# EAGLE schematic Minidev_V1.0 (EAGLE 8.7.1)
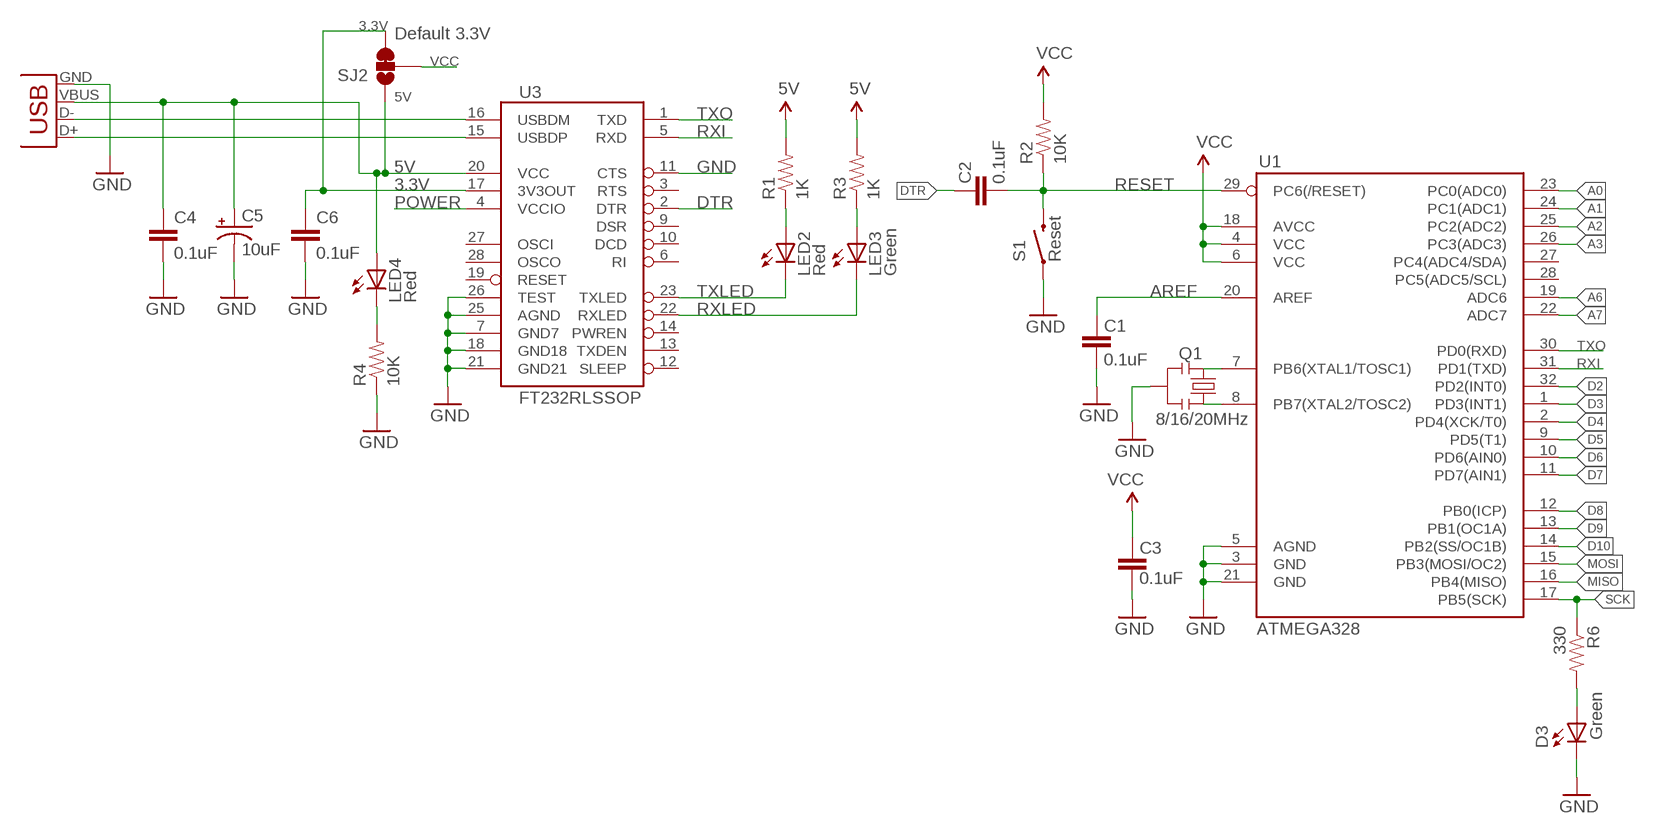
[diagram p0: schematic, sheet 1]

## Parts
C1  0.1uF  CAP0603-CAP  [0603-CAP]
C2  0.1uF  CAP0603-CAP  [0603-CAP]
C3  0.1uF  CAP0603-CAP  [0603-CAP]
C4  0.1uF  CAP0402-CAP  [0402-CAP]
C5  10uF  CAP_POL1206  [EIA3216]
C6  0.1uF  CAP0402-CAP  [0402-CAP]
D3  Green  LED  [0603-LED-ALT1]
LED2  Red  LED0603  [LED-0603]
LED3  Green  LED0603  [LED-0603]
LED4  Red  LED  [0603-LED-ALT1]
Q1  8/16/20MHz  RESONATOR1:1  [RESONATOR-SMD-1:1]
R1  1K  RESISTOR0402-RES  [0402-RES]
R2  10K  RESISTOR0603-RES  [0603-RES]
R3  1K  RESISTOR0402-RES  [0402-RES]
R4  10K  RESISTOR0603-RES  [0603-RES]
R6  330  RESISTOR0603-RES  [0603-RES]
S1  Reset  SWITCH-MOMENTARY-2SMD-ALT01  [TACTILE-SWITCH-SMD-ALT01]
SJ2  SOLDERJUMPER_2WAYS  [SJ_3]
U1  ATMEGA328  ATMEGA168  [TQFP32-08]
U3  FT232RLSSOP  [SSOP28DB]
X2  USB-SMD-NS  [USB-MINIB-NOSTOP]

## Nets
3.3V [power]: C6.1 SJ2.3 U3.17(3V3OUT)
5V: C4.1 C5.A(+) LED4.A R1.2 R3.2 SJ2.1 U3.20(VCC) X2.VBUS
A0: U1.23(PC0(ADC0))
A1: U1.24(PC1(ADC1))
A2: U1.25(PC2(ADC2))
A3: U1.26(PC3(ADC3))
A6: U1.19(ADC6)
A7: U1.22(ADC7)
AREF: C1.2 U1.20(AREF)
D2: U1.32(PD2(INT0))
D3: U1.1(PD3(INT1))
D4: U1.2(PD4(XCK/T0))
D5: U1.9(PD5(T1))
D6: U1.10(PD6(AIN0))
D7: U1.11(PD7(AIN1))
D8: U1.12(PB0(ICP))
D9: U1.13(PB1(OC1A))
D10: U1.14(PB2(SS/OC1B))
DTR: C2.2 U3.2(DTR)
GND [power]: C1.1 C3.1 C4.2 C5.C(-) C6.2 D3.C Q1.2 R4.1 S1.1 S1.2 U1.3(GND) U1.5(AGND) U1.21(GND) U3.7(GND7) U3.11(CTS) U3.18(GND18) U3.21(GND21) U3.25(AGND) U3.26(TEST) X2.GND
MISO: U1.16(PB4(MISO))
MOSI: U1.15(PB3(MOSI/OC2))
N$1: Q1.3 U1.8(PB7(XTAL2/TOSC2))
N$2: Q1.1 U1.7(PB6(XTAL1/TOSC1))
N$5: LED2.A R1.1
N$6: LED3.A R3.1
N$7: D3.A R6.2
N$9: LED4.C R4.2
POWER: U3.4(VCCIO)
RESET: C2.1 R2.1 S1.3 S1.4 U1.29(PC6(/RESET))
RXI: U1.31(PD1(TXD)) U3.5(RXD)
RXLED: LED3.C U3.22(RXLED)
SCK: R6.1 U1.17(PB5(SCK))
TXLED: LED2.C U3.23(TXLED)
TXO: U1.30(PD0(RXD)) U3.1(TXD)
USB_D+: U3.15(USBDP) X2.D+
USB_D-: U3.16(USBDM) X2.D-
VCC: C3.2 R2.2 SJ2.2 U1.4(VCC) U1.6(VCC) U1.18(AVCC)
Unconnected: U1.27(PC4(ADC4/SDA)) U1.28(PC5(ADC5/SCL)) U3.3(RTS) U3.6(RI) U3.9(DSR) U3.10(DCD) U3.12(SLEEP) U3.13(TXDEN) U3.14(PWREN) U3.19(RESET) U3.27(OSCI) U3.28(OSCO)

## Notes on the sheet
- Default 3.3V

## Library data of the parts
C1-C4 C6 = SparkFun:CAP: Capacitor Standard 0603 ceramic capacitor, and 0.1" leaded capacitor.
C5 = SparkFun:CAP_POL: Capacitor Polarized These are standard SMD and PTH capacitors. Normally 10uF, 47uF, and 100uF in electrolytic and tantalum varieties. Always verify the external diameter of the through hole cap, it varies with capacity, voltage, and manufacturer. The EIA devices should be standard.
D3 LED4 = Testing:LED: LEDs Standard schematic elements and footprints for 5mm, 3mm, 1206, and 0603 sized LEDs. 5mm - Spark Fun Electronics SKU : COM-00529 (and others)
LED2 LED3 = SparkFun:LED: LEDs Standard schematic elements and footprints for 5mm, 3mm, 1206, and 0603 sized LEDs. 5mm - Spark Fun Electronics SKU : COM-00529 (and others)
Q1 = Testing:RESONATOR: Resonator Small SMD resonator. This is the itty bitty 10/20MHz resonators with built in caps. CSTCE10M0G55 and CSTCE20M0V53. Footprint for SMD has been used in SFE production for years, and does work okay. 1:1 is an attempt to get larger fillets on the sides so it will be easier to inspect these solders in our AOI machine. The pads have been minimized to match the actual metal under the resonator. To see this relation, it includes an image import of the bottom side of the component. Imported to scale on layer 200.
R1-R4 R6 = SparkFun:RESISTOR: Resistor Basic schematic elements and footprints for 0603, 1206, and PTH resistors.
S1 = Testing:SWITCH-MOMENTARY-2: Various NO switches- pushbuttons, reed, etc
SJ2 = SparkFun:SOLDERJUMPER_2WAY: Solder Jumper 2 way solder jumper
U1 = SparkFun:ATMEGA168
U3 = SparkFun:FT232RL: USB UART FT232RL 4th Generation USB UART (USB <-> Serial) Controller. Spark Fun Electronics SKU : COM-00650
X2 = SparkFun:USB: USB Connectors USB-B-PTH is fully proven SKU : PRT-00139 USB-miniB is fully proven SKU : PRT-00587 USB-A-PCB is untested. USB-A-H is throughly reviewed, but untested. Spark Fun Electronics SKU : PRT-00437 USB-B-SMT is throughly reviewed, but untested. Needs silkscreen touching up. USB-A-S has not been used/tested USB-MB-H has not been used/tested

## Net classes
0 default: width 0.203 mm
1 power: width 0.254 mm